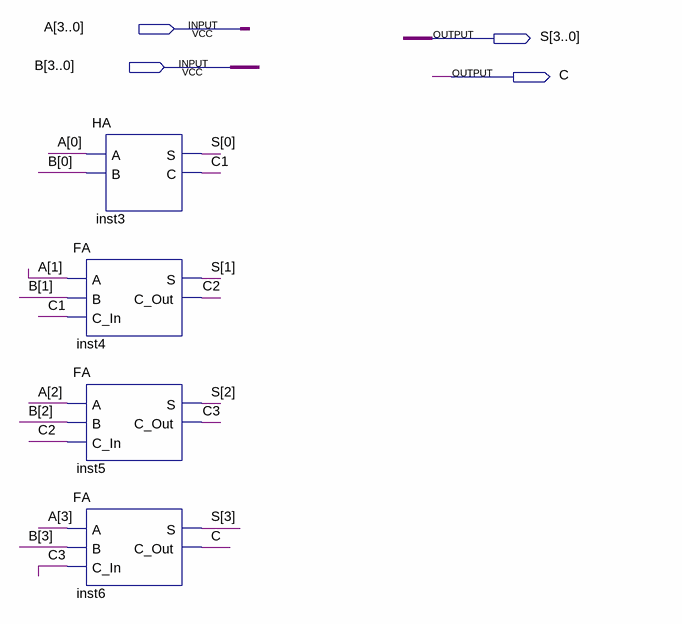
[diagram p0: schematic sheet]
// Quartus schematic LAB_01.bdf as structural Verilog: 4 symbols, 4 pins
module LAB_01 (
  input  [3:0] A,
  input  [3:0] B,
  output [3:0] S,
  output C
);

  wire C1, C2, C3;

  HA inst3 (.A(A[0]), .B(B[0]), .S(S[0]), .C(C1));
  FA inst4 (.A(A[1]), .B(B[1]), .C_In(C1), .S(S[1]), .C_Out(C2));
  FA inst5 (.A(A[2]), .B(B[2]), .C_In(C2), .S(S[2]), .C_Out(C3));
  FA inst6 (.A(A[3]), .B(B[3]), .C_In(C3), .S(S[3]), .C_Out(C));
endmodule
